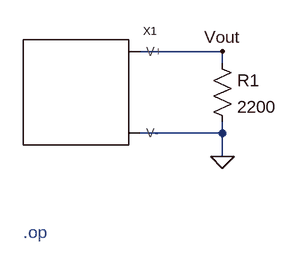
[diagram p0: schematic lab3.asc]
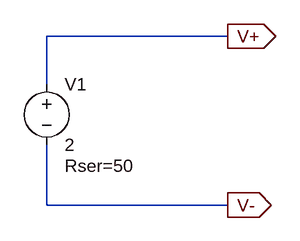
[diagram p1: sub-circuit fgen.asc]
lab3.asc, the LTspice schematic file:
Version 4.1
SHEET 1 880 680
WIRE 288 128 176 128
WIRE 288 144 288 128
WIRE 288 240 288 224
WIRE 288 240 176 240
WIRE 288 272 288 240
FLAG 288 272 0
FLAG 288 128 Vout
SYMBOL FGen 96 192 R0
SYMATTR InstName X1
SYMBOL res 272 128 R0
SYMATTR InstName R1
SYMATTR Value 2200
TEXT 16 376 Left 2 ;.op

fgen.asc, the sub-circuit schematic file:
Version 4
SHEET 1 880 680
WIRE 368 80 128 80
WIRE 128 144 128 80
WIRE 128 304 128 224
WIRE 368 304 128 304
FLAG 368 80 V+
IOPIN 368 80 Out
FLAG 368 304 V-
IOPIN 368 304 Out
SYMBOL voltage 128 128 R0
WINDOW 123 0 0 Left 0
WINDOW 39 24 124 Left 2
SYMATTR InstName V1
SYMATTR Value 2
SYMATTR SpiceLine Rser=50

The netlist it stands for:
* lab3.asc
X§X1 Vout 0 fgen
R1 Vout 0 2200

* block symbol definitions
.subckt fgen V+ V-
V1 V+ V- 2 Rser=50
.ends fgen

* .op
.backanno
.end